# Altium schematic sheet Sheet1 - 副本.SchDoc
size A4
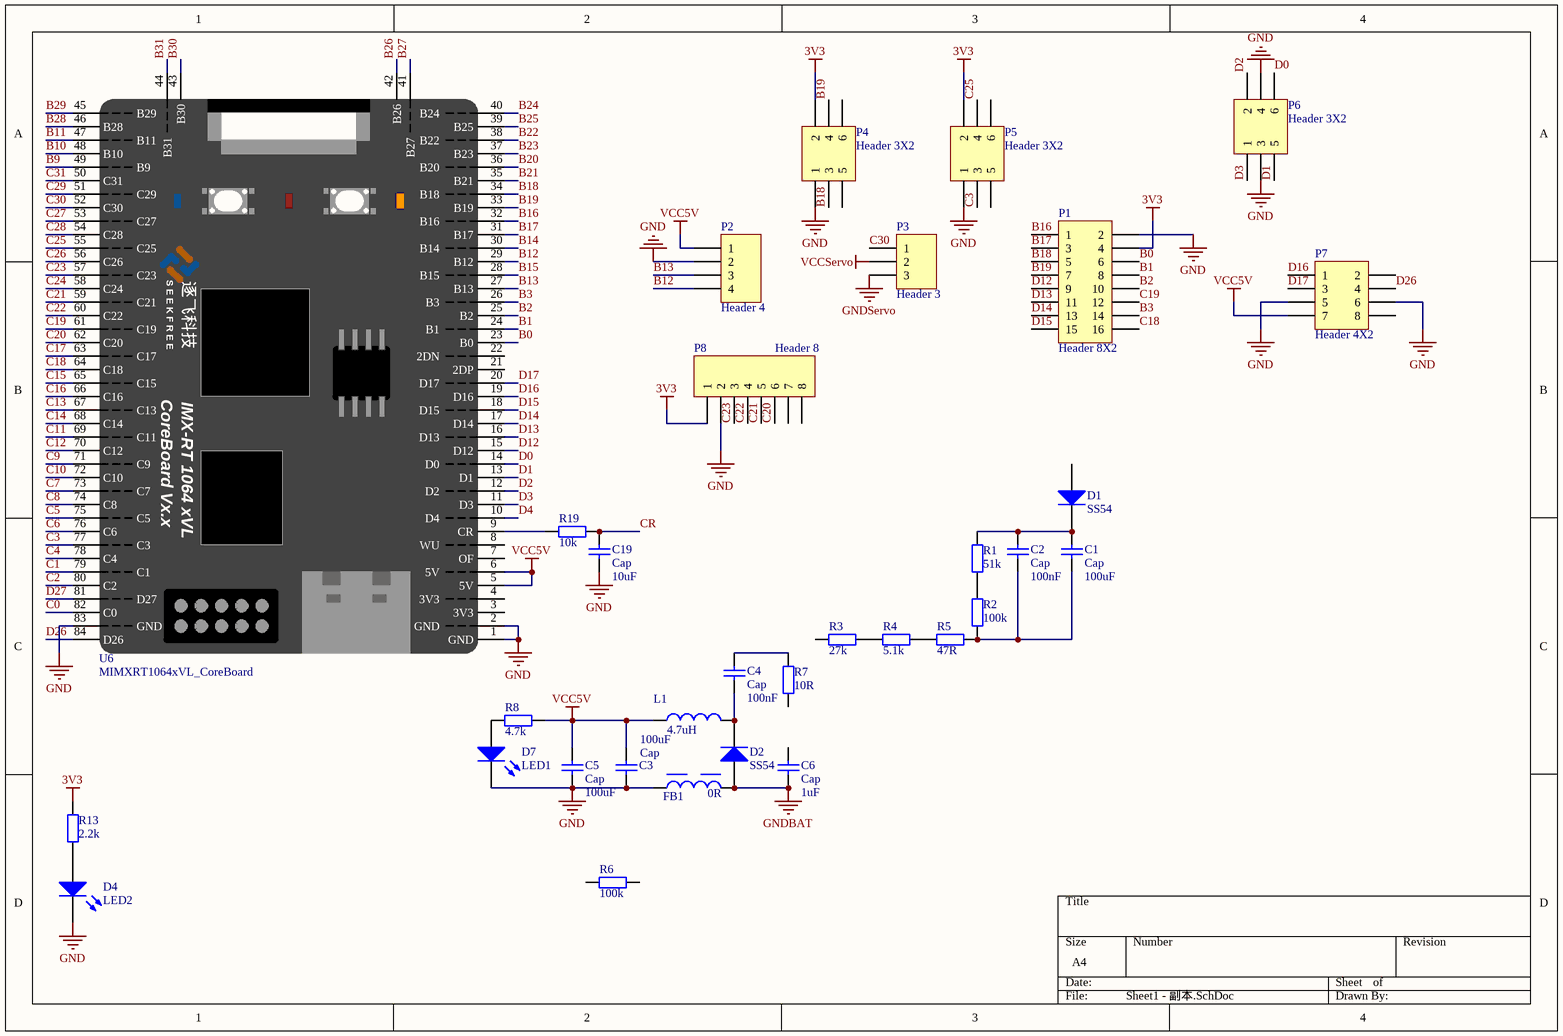
[diagram p0: Sheet1 - 副本.SchDoc]

## Parts
C1  Cap  value 100uF  [0603C]
C2  Cap  value 100nF  [0603C]
C3  Cap  value 100uF  [0603C]
C4  Cap  value 100nF  [0603C]
C5  Cap  value 100uF  [0603C]
C6  Cap  value 1uF  [0603C]
C19  Cap  value 10uF  [0603C]
D1  SS54  [ss54]
D2  SS54  [ss54]
D4  LED2  [0603C]
D7  LED1  [0603C]
FB1  0R  [0805]
L1  4.7uH  [4R7]
P1  Header 8X2  [HDR2X8]
P2  Header 4  [HDR1X4]
P3  Header 3  [HDR1X3]
P4  Header 3X2  [HDR2X3]
P5  Header 3X2  [HDR2X3]
P6  Header 3X2  [HDR2X3]
P7  Header 4X2  [HDR2X4]
P8  Header 8  [HDR1X8]
R1  value 51k  [0603C]  (hidden comment: Res2)
R2  value 100k  [0603C]  (hidden comment: Res2)
R3  value 27k  [0603C]  (hidden comment: Res2)
R4  value 5.1k  [0603C]  (hidden comment: Res2)
R5  value 47R  [0603C]  (hidden comment: Res2)
R6  value 100k  [0603C]  (hidden comment: Res2)
R7  value 10R  [0603C]  (hidden comment: Res2)
R8  value 4.7k  [0603C]  (hidden comment: Res2)
R13  value 2.2k  [0603C]  (hidden comment: Res2)
R19  value 10k  [0603C]  (hidden comment: Res2)
U6  MIMXRT1064xVL_CoreBoard  [MIMXRT1064xVL_CoreBoard]

## Nets
3V3: P1.4 P4.2 P5.2 P8.1 R13.2
GND: C3.1 C5.1 C19.1 D4.2(K) D7.2(K) FB1.1 P1.2 P2.2 P4.1 P5.1 P6.3 P6.4 P7.5 P7.6 P8.2 U6.1(GND) U6.2(GND) U6.83(GND)
GNDBAT: C6.1 D2.1(A) FB1.2
GNDServo: P3.3
VCC5V: C3.2 C5.2 L1.1 P2.1 P7.7 R8.2 U6.5(5V) U6.6(5V)
VCCServo: P3.2
B0: P1.6 U6.23(B0)
B1: P1.8 U6.24(B1)
B2: P1.10 U6.25(B2)
B3: P1.14 U6.26(B3)
B9: U6.49(B9)
B10: U6.48(B10)
B11: U6.47(B11)
B12: P2.4 U6.29(B12)
B13: P2.3 U6.27(B13)
B14: U6.30(B14)
B15: U6.28(B15)
B16: P1.1 U6.32(B16)
B17: P1.3 U6.31(B17)
B18: P1.5 P4.3 U6.34(B18)
B19: P1.7 P4.4 U6.33(B19)
B20: U6.36(B20)
B21: U6.35(B21)
B22: U6.38(B22)
B23: U6.37(B23)
B24: U6.40(B24)
B25: U6.39(B25)
B26: U6.42(B26)
B27: U6.41(B27)
B28: U6.46(B28)
B29: U6.45(B29)
B30: U6.43(B30)
B31: U6.44(B31)
C0: U6.82(C0)
C1: U6.79(C1)
C2: U6.80(C2)
C3: P5.3 U6.77(C3)
C4: U6.78(C4)
C5: U6.75(C5)
C6: U6.76(C6)
C7: U6.73(C7)
C8: U6.74(C8)
C9: U6.71(C9)
C10: U6.72(C10)
C11: U6.69(C11)
C12: U6.70(C12)
C13: U6.67(C13)
C14: U6.68(C14)
C15: U6.65(C15)
C16: U6.66(C16)
C17: U6.63(C17)
C18: P1.16 U6.64(C18)
C19: P1.12 U6.61(C19)
C20: P8.6 U6.62(C20)
C21: P8.5 U6.59(C21)
C22: P8.4 U6.60(C22)
C23: P8.3 U6.57(C23)
C24: U6.58(C24)
C25: P5.4 U6.55(C25)
C26: U6.56(C26)
C27: U6.53(C27)
C28: U6.54(C28)
C29: U6.51(C29)
C30: P3.1 U6.52(C30)
C31: U6.50(C31)
CR: C19.2 R19.2
D0: P6.6 U6.14(D0)
D1: P6.5 U6.13(D1)
D2: P6.2 U6.12(D2)
D3: P6.1 U6.11(D3)
D4: U6.10(D4)
D12: P1.9 U6.15(D12)
D13: P1.11 U6.16(D13)
D14: P1.13 U6.17(D14)
D15: P1.15 U6.18(D15)
D16: P7.1 U6.19(D16)
D17: P7.3 U6.20(D17)
D26: P7.4 U6.84(D26)
D27: U6.81(D27)
NetC1_1: C1.1 C2.1 R2.1 R5.2
NetC1_2: C1.2 C2.2 D1.2(K) R1.2
NetC4_1: C4.1 D2.2(K) L1.2
NetC4_2: C4.2 R7.2
NetD4_1: D4.1(A) R13.1
NetD7_1: D7.1(A) R8.1
NetR1_1: R1.1 R2.2
NetR3_2: R3.2 R4.1
NetR4_2: R4.2 R5.1
NetR19_1: R19.1 U6.9(CR)

Not connected (* = marked no-connect by the designer): C6 2; D1 1(A); P4 5 6; P5 5 6; P7 2 8; P8 7 8; R3 1; R6 1 2; R7 1; U6 3(3V3) 4(3V3) 7(OF) 8(WU) 21(2DP) 22(2DN)

## Notes on the sheet
- (in symbol MIMXRT1064xVL_CoreBoard) S E E K F R E E; 逐飞科技; CoreBoard Vx.x; IMX-RT 1064 xVL

## Library data of the parts
C1-C6 C19 = Cap: Capacitor; Published: 8-Jun-2000; LatestRevisionDate: 17-Jul-2002; LatestRevisionNote: Re-released for DXP Platform.; PackageReference: RAD-0.3; Publisher: Altium Limited; PackageDescription: Radial Cap, Thru-Hole; 2 Leads; 0.3 in Pin Spacing
D1 D2 = Diode_1: Default Diode; Published: 8-Jun-2000; LatestRevisionDate: 17-Jul-2002; LatestRevisionNote: Re-released for DXP Platform.; PackageVersion: Sep-1996; PackageReference: SMC; Publisher: Altium Limited; PackageDescription: DO-214-AB/SMC; 2 C-Bend Leads; Body 7.9 x 5.9 mm, inc. leads (LxW); Code_JEDEC: DO-214-AB
D4 D7 = LED2: Typical RED, GREEN, YELLOW, AMBER GaAs LED; Published: 8-Jun-2000; LatestRevisionDate: 17-Jul-2002; LatestRevisionNote: Re-released for DXP Platform.; PackageVersion: Feb-2002; PackageReference: 3.2X1.6X1.1; Publisher: Altium Limited; PackageDescription: SM LED; 2 Flat Leads
FB1 = FB: Inductor; Code_IEC: 1005; Published: 8-Jun-2000; LatestRevisionDate: 29-May-2009; LatestRevisionNote: IPC-7351 Footprint Added.; PackageReference: 0402-A; Publisher: Altium Limited; PackageDescription: Chip Inductor; Code_JEITA: 0402
L1 = Inductor_2: Inductor; Code_IEC: 1005; Published: 8-Jun-2000; LatestRevisionDate: 29-May-2009; LatestRevisionNote: IPC-7351 Footprint Added.; PackageReference: 0402-A; Publisher: Altium Limited; PackageDescription: Chip Inductor; Code_JEITA: 0402
P1 = Header 8X2: Header, 8-Pin, Dual row; LatestRevisionDate: 17-Jul-2002; LatestRevisionNote: Re-released for DXP Platform.; Publisher: Altium Limited
P2 = Header 4: Header, 4-Pin; LatestRevisionDate: 17-Jul-2002; LatestRevisionNote: Re-released for DXP Platform.; Publisher: Altium Limited
P3 = Header 3: Header, 3-Pin; LatestRevisionDate: 17-Jul-2002; LatestRevisionNote: Re-released for DXP Platform.; Publisher: Altium Limited
P4-P6 = Header 3X2: Header, 3-Pin, Dual row; LatestRevisionDate: 17-Jul-2002; LatestRevisionNote: Re-released for DXP Platform.; Publisher: Altium Limited
P7 = Header 4X2: Header, 4-Pin, Dual row; LatestRevisionDate: 17-Jul-2002; LatestRevisionNote: Re-released for DXP Platform.; Publisher: Altium Limited
P8 = Header 8: Header, 8-Pin; LatestRevisionDate: 17-Jul-2002; LatestRevisionNote: Re-released for DXP Platform.; Publisher: Altium Limited
R1-R8 R13 R19 = Res2: Resistor; Published: 8-Jun-2000; LatestRevisionDate: 17-Jul-2002; LatestRevisionNote: Re-released for DXP Platform.; PackageReference: AXIAL-0.4; Publisher: Altium Limited; PackageDescription: Axial Device, Thru-Hole; 2 Leads; 0.4 in Pin Spacing
U6 = MIMXRT1064xVL_CoreBoard: 逐飞科技i.MX RT1064核心板整体原理，可直接使用